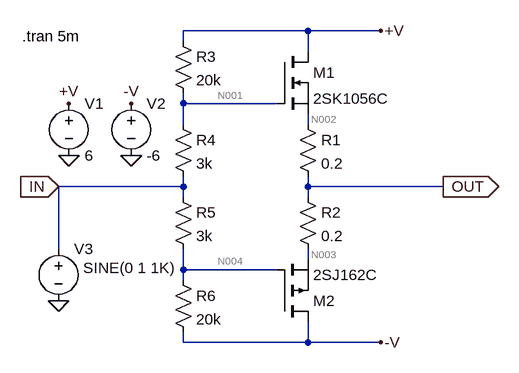
[diagram p0: schematic Circuit7_19.asc]
Circuit7_19.asc, the LTspice schematic file:
Version 4
SHEET 1 1092 680
WIRE 80 80 -112 80
WIRE 192 80 80 80
WIRE -112 96 -112 80
WIRE 80 112 80 80
WIRE -112 192 -112 176
WIRE 32 192 -112 192
WIRE -112 224 -112 192
WIRE 80 224 80 208
WIRE -112 320 -112 304
WIRE -112 320 -304 320
WIRE 80 320 80 304
WIRE 288 320 80 320
WIRE -112 336 -112 320
WIRE 80 336 80 320
WIRE -304 416 -304 320
WIRE 80 432 80 416
WIRE -112 448 -112 416
WIRE 32 448 -112 448
WIRE -112 464 -112 448
WIRE -112 560 -112 544
WIRE 80 560 80 528
WIRE 80 560 -112 560
WIRE 192 560 80 560
FLAG -288 272 0
FLAG -192 272 0
FLAG -304 496 0
FLAG 192 80 +V
FLAG -288 192 +V
FLAG 192 560 -V
FLAG -192 192 -V
FLAG -304 320 IN
IOPIN -304 320 In
FLAG 288 320 OUT
IOPIN 288 320 Out
SYMBOL res 64 208 R0
SYMATTR InstName R1
SYMATTR Value 0.2
SYMBOL res 64 320 R0
SYMATTR InstName R2
SYMATTR Value 0.2
SYMBOL res -128 80 R0
SYMATTR InstName R3
SYMATTR Value 20k
SYMBOL res -128 208 R0
SYMATTR InstName R4
SYMATTR Value 3k
SYMBOL res -128 448 R0
SYMATTR InstName R6
SYMATTR Value 20k
SYMBOL voltage -288 176 R0
SYMATTR InstName V1
SYMATTR Value 6
SYMBOL voltage -192 176 R0
SYMATTR InstName V2
SYMATTR Value -6
SYMBOL voltage -304 400 R0
WINDOW 3 38 45 Left 2
WINDOW 39 0 0 Left 0
SYMATTR Value SINE(0 1 1K)
SYMATTR InstName V3
SYMBOL res -128 320 R0
SYMATTR InstName R5
SYMATTR Value 3k
SYMBOL nmos 32 112 R0
SYMATTR InstName M1
SYMATTR Value 2SK1056C
SYMBOL pmos 32 528 M180
SYMATTR InstName M2
SYMATTR Value 2SJ162C
TEXT -360 88 Left 2 !.tran 5m

The netlist it stands for:
* Circuit7_19.asc
R1 N002 OUT 0.2
R2 OUT N003 0.2
R3 +V N001 20k
R4 N001 IN 3k
R6 N004 -V 20k
V1 +V 0 6
V2 -V 0 -6
V3 IN 0 SINE(0 1 1K)
R5 IN N004 3k
M1 +V N001 N002 N002 2SK1056C
M2 -V N004 N003 N003 2SJ162C
.model NMOS NMOS
.model PMOS PMOS
.lib standard.mos
.tran 5m
.backanno
.end

* Results of the author's LTspice run, read from the files saved beside the schematic
* Operating Point, zero values left out:
*   V(n002) = 57.53 mV
*   V(out) = 23.44 mV
*   V(n003) = -10.65 mV
*   V(+v) = 6 V
*   V(n001) = 782.6 mV
*   V(n004) = -782.6 mV
*   V(-v) = -6 V
*   Id(M2) = -170.5 mA
*   Is(M2) = 170.5 mA
*   Id(M1) = 170.5 mA
*   Is(M1) = -170.5 mA
*   I(R5) = 260.9 µA
*   I(R6) = 260.9 µA
*   I(R4) = 260.9 µA
*   I(R3) = 260.9 µA
*   I(R2) = 170.5 mA
*   I(R1) = 170.5 mA
*   I(V2) = 170.7 mA
*   I(V1) = -170.7 mA
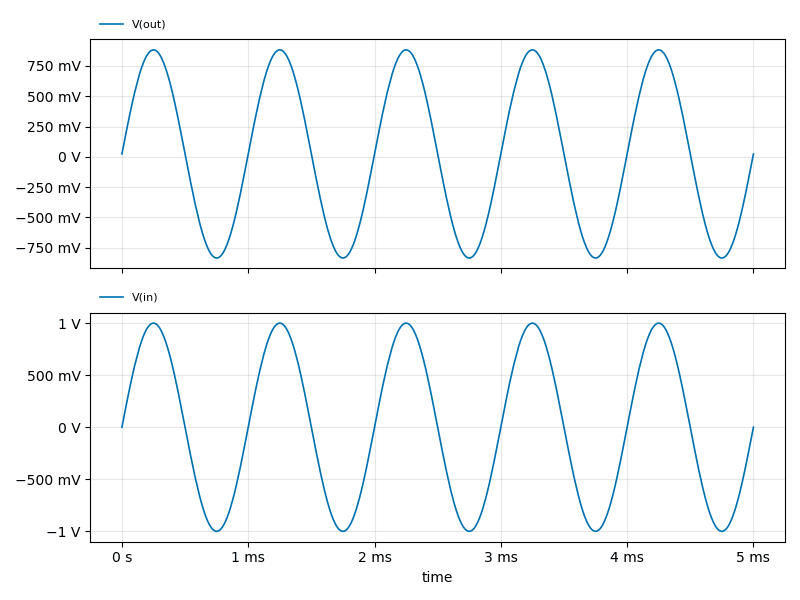
[diagram p1: Transient Analysis of Circuit7_19.asc, plotted from the saved traces]
* Transient Analysis, 1 run:
*   V(out): min -835.2 mV, max 882.6 mV, average 23.51 mV, rms 608.6 mV, last 22.65 mV
*   V(in): min -1 V, max 1 V, average -49.8 µV, rms 708 mV, last 0 V